# EAGLE schematic Edmonton Organ (EAGLE 7.6.0)
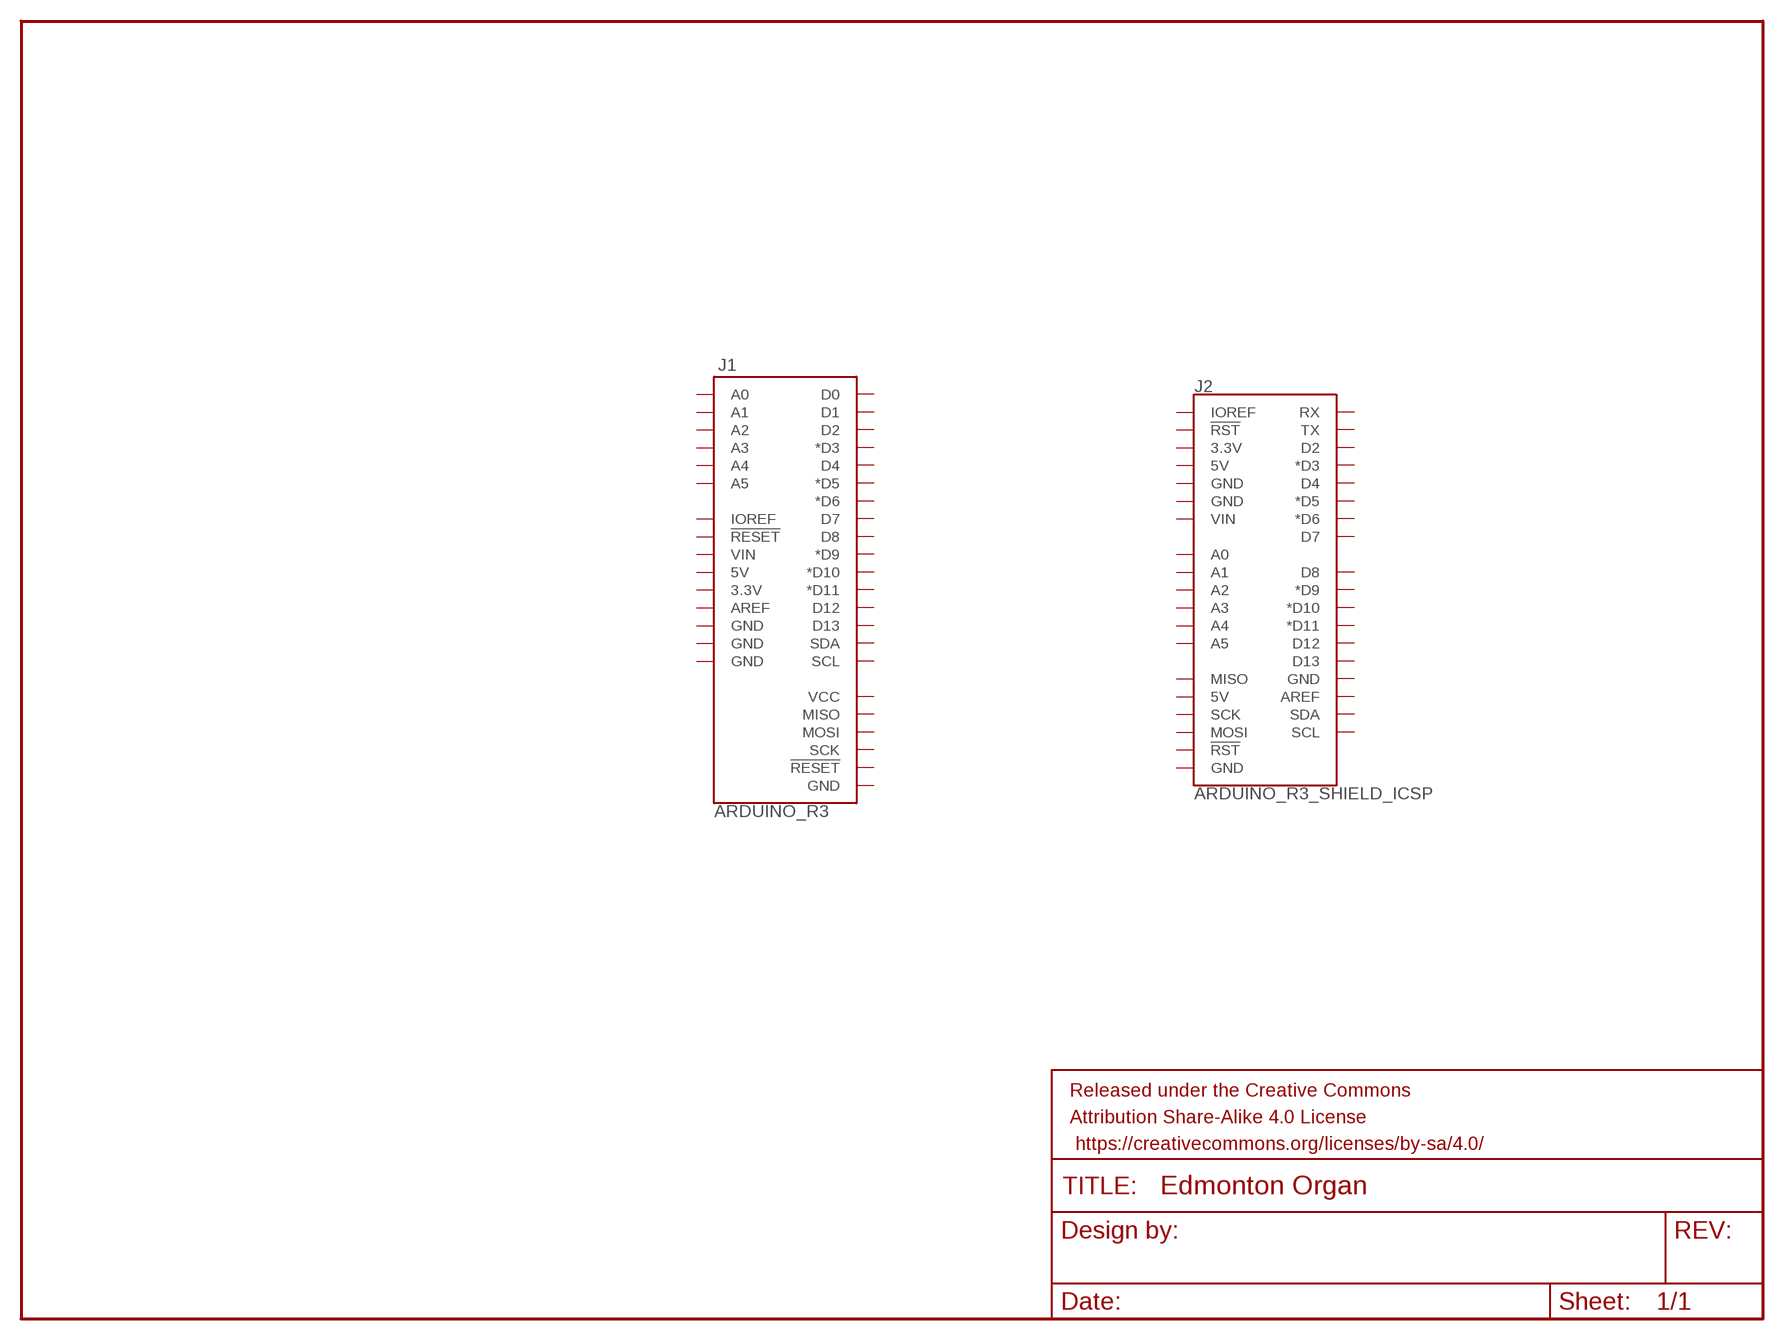
[diagram p0: schematic, sheet 1]

## Parts
FRAME1  FRAME-LETTER  [CREATIVE_COMMONS]
J1  ARDUINO_R3  [ARDUINO_R3]
J2  ARDUINO_R3_SHIELD_ICSP  [UNO_R3_SHIELD_ICSP]
Unconnected: J1.3.3V J1.5V J1.A0 J1.A1 J1.A2 J1.A3 J1.A4 J1.A5 J1.AREF J1.D0 J1.D1 J1.D2 J1.D3(*D3) J1.D4 J1.D5(*D5) J1.D6(*D6) J1.D7 J1.D8 J1.D9(*D9) J1.D10(*D10) J1.D11(*D11) J1.D12 J1.D13 J1.GND@1(GND) J1.GND@2(GND) J1.GND@3(GND) J1.GND@4(GND) J1.IOREF J1.MISO J1.MOSI J1.RESET@1(!RESET!) J1.RESET@2(!RESET!) J1.SCK J1.SCL J1.SDA J1.VCC J1.VIN J2.3.3V J2.5V J2.5V_ICSP(5V) J2.A0 J2.A1 J2.A2 J2.A3 J2.A4 J2.A5 J2.AREF J2.D2 J2.D3(*D3) J2.D4 J2.D5(*D5) J2.D6(*D6) J2.D7 J2.D8 J2.D9(*D9) J2.D10(*D10) J2.D11(*D11) J2.D12 J2.D13 J2.GND@0(GND) J2.GND@1(GND) J2.GND@2(GND) J2.GND_ICSP(GND) J2.IOREF J2.MISO J2.MOSI J2.RES(!RST!) J2.RST_ICSP(!RST!) J2.RX J2.SCK J2.SCL J2.SDA J2.TX J2.VIN

## Library data of the parts
FRAME1 = SparkFun-Aesthetics:FRAME-LETTER: Schematic Frame Standard 8.5x11 US Letter frame
J1 = SparkFun-Boards:ARDUINO_R3: Arduino R3 Footprint (w/ SPI header)
J2 = SparkFun-Boards:ARDUINO_R3_SHIELD_ICSP: Arduino R3 Shield Footprint w/ 6-pin (2x3) ICSP Header